# EAGLE schematic tulip breakout (EAGLE 9.6.2)
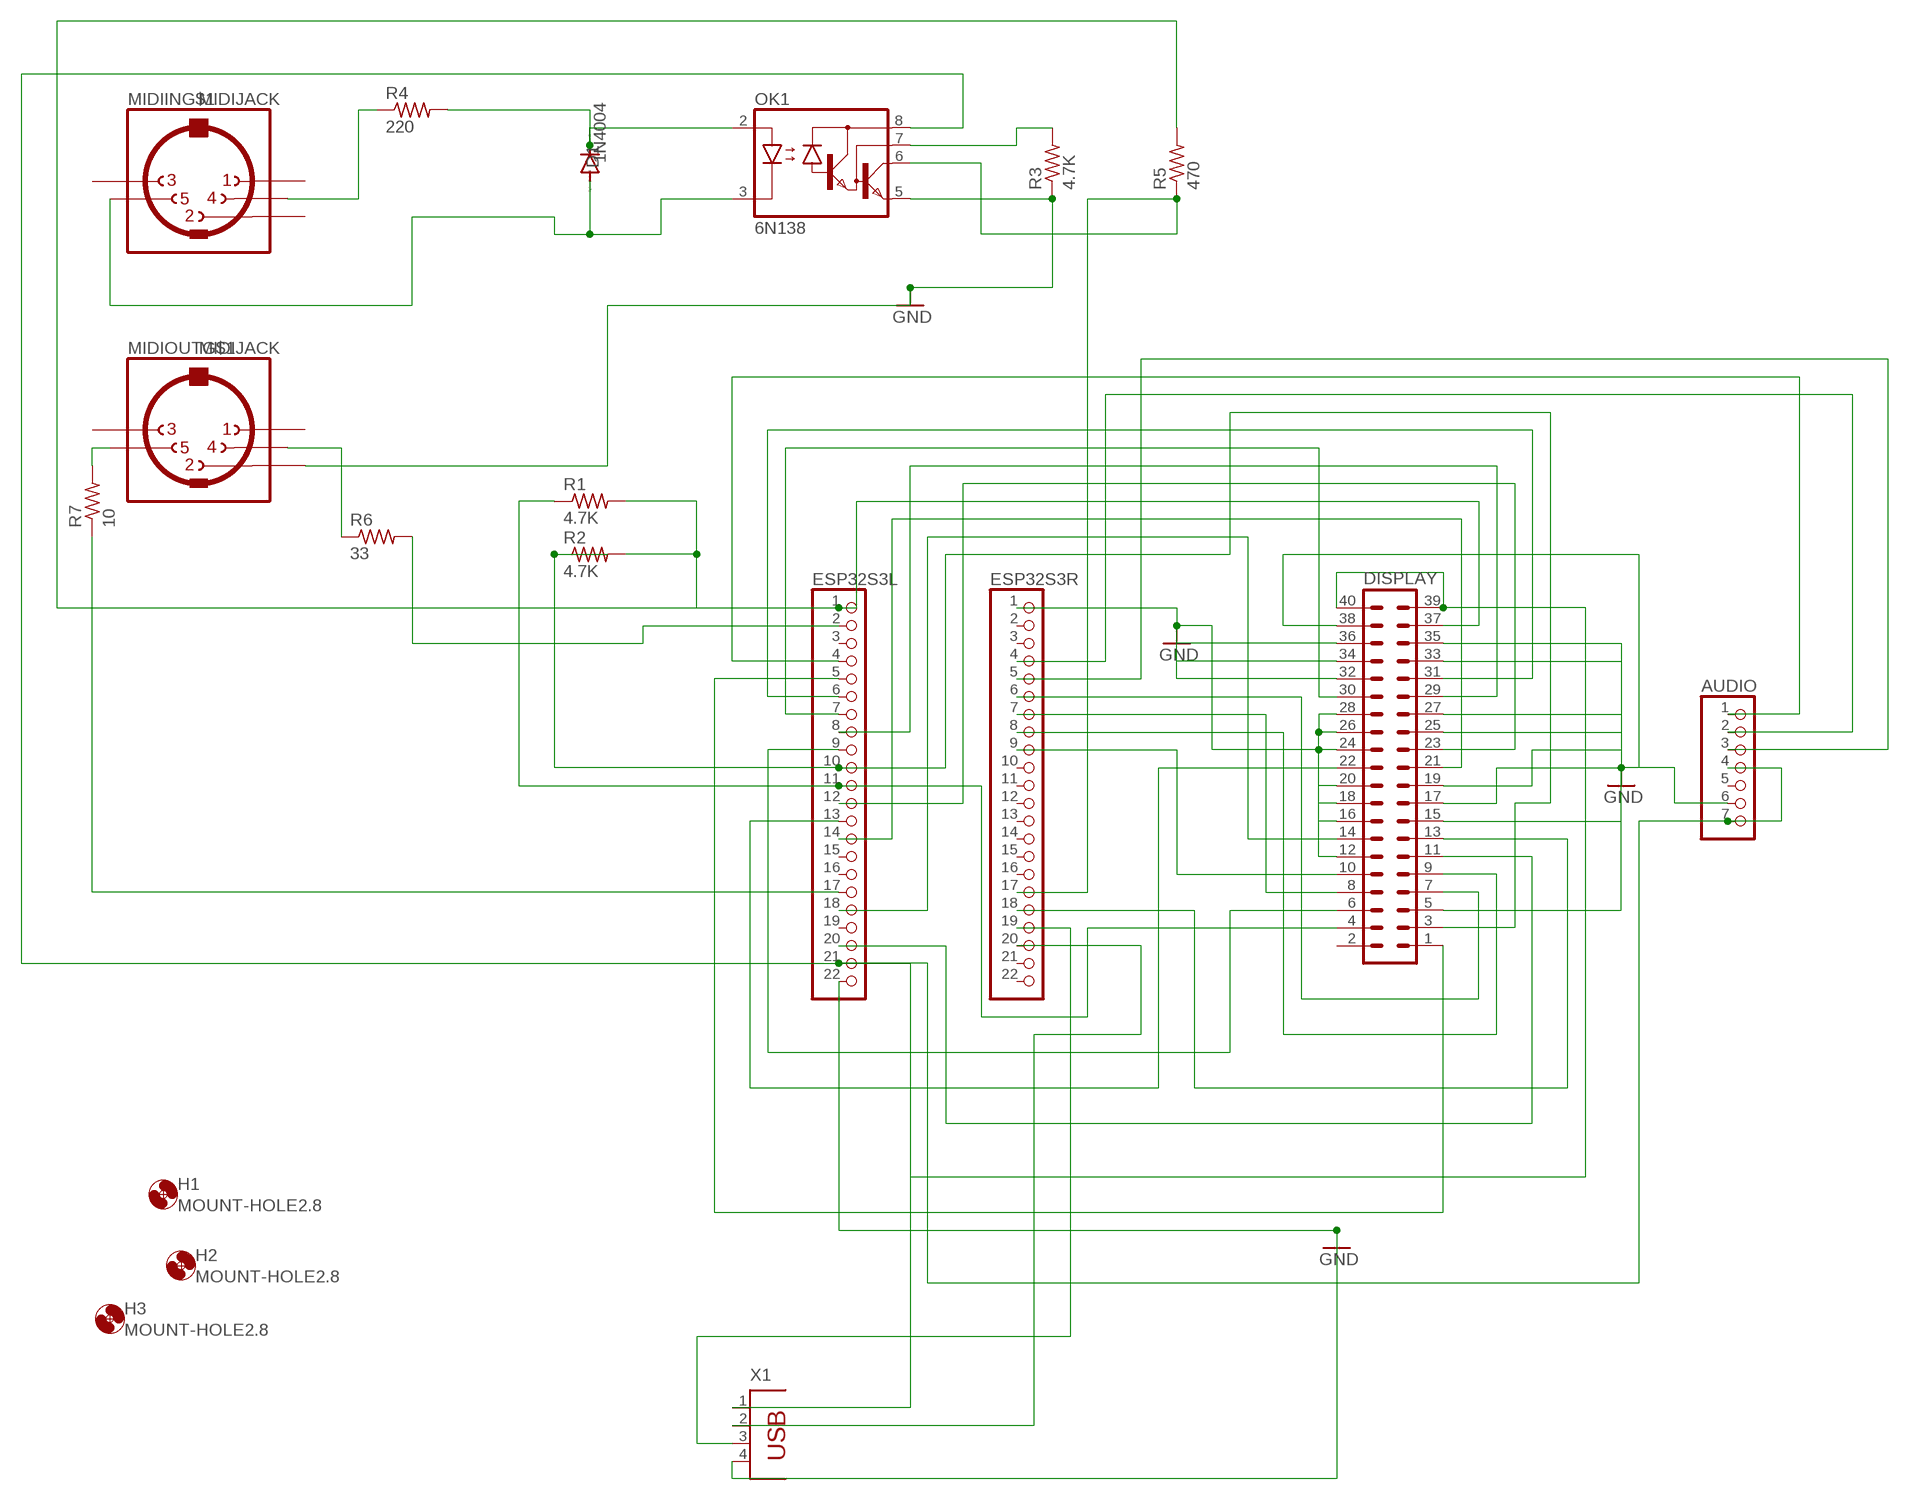
[diagram p0: schematic, sheet 1]

## Parts
AUDIO  PINHD-1X7  [1X07]
D1  1N4004  [DO41-10]
DISPLAY  MA20-2  [MA20-2]
ESP32S3L  PINHD-1X22  [1X22]
ESP32S3R  PINHD-1X22  [1X22]
H1  MOUNT-HOLE2.8  [2,8]
H2  MOUNT-HOLE2.8  [2,8]
H3  MOUNT-HOLE2.8  [2,8]
MIDIIN  MIDIJACK  [CP-2350]
MIDIOUT  MIDIJACK  [CP-2350]
OK1  6N138  [DIL08]
R1  4.7K  R-US_0204/7  [0204/7]
R2  4.7K  R-US_0204/7  [0204/7]
R3  4.7K  R-US_0204/7  [0204/7]
R4  220  R-US_0204/7  [0204/7]
R5  470  R-US_0204/7  [0204/7]
R6  33  R-US_0204/7  [0204/7]
R7  10  R-US_0204/7  [0204/7]
X1  PN87520  [PN87520]

## Nets
GND: AUDIO.6 DISPLAY.5 DISPLAY.12 DISPLAY.15 DISPLAY.16 DISPLAY.17 DISPLAY.18 DISPLAY.19 DISPLAY.20 DISPLAY.24 DISPLAY.25 DISPLAY.26 DISPLAY.27 DISPLAY.28 DISPLAY.32 DISPLAY.33 DISPLAY.34 DISPLAY.35 DISPLAY.36 DISPLAY.38 ESP32S3L.22 ESP32S3R.1 MIDIOUT.2 OK1.5(GND) R3.1 X1.4
N$1: DISPLAY.6 ESP32S3L.9
N$2: DISPLAY.7 ESP32S3R.6
N$3: DISPLAY.8 ESP32S3R.7
N$4: DISPLAY.9 ESP32S3R.8
N$6: DISPLAY.10 ESP32S3R.9
N$7: DISPLAY.11 ESP32S3L.20
N$8: DISPLAY.13 ESP32S3R.18
N$9: DISPLAY.14 ESP32S3L.18
N$10: AUDIO.4 AUDIO.7 DISPLAY.39 DISPLAY.40 ESP32S3L.21 OK1.8(VCC) X1.1
N$11: DISPLAY.21 ESP32S3L.14
N$12: DISPLAY.22 ESP32S3L.13
N$13: DISPLAY.23 ESP32S3L.12
N$14: DISPLAY.29 ESP32S3L.8
N$15: DISPLAY.30 ESP32S3L.7
N$16: DISPLAY.31 ESP32S3L.6
N$17: DISPLAY.37 ESP32S3L.1 R1.2 R2.2 R5.2
N$18: DISPLAY.4 ESP32S3L.11 R1.1
N$19: ESP32S3R.17 OK1.6(VO) R5.1
N$20: DISPLAY.1 ESP32S3L.5
N$21: AUDIO.1 ESP32S3L.4
N$22: AUDIO.2 ESP32S3R.4
N$23: AUDIO.3 ESP32S3R.5
N$24: ESP32S3R.20 X1.2
N$25: ESP32S3R.19 X1.3
N$26: DISPLAY.3 ESP32S3L.10 R2.1
N$27: ESP32S3L.17 R7.1
N$29: MIDIIN.4 R4.1
N$30: D1.C OK1.2(A) R4.2
N$31: D1.A MIDIIN.5 OK1.3(C)
N$32: OK1.7(VB) R3.2
N$34: MIDIOUT.5 R7.2
N$35: MIDIOUT.4 R6.1
N$36: ESP32S3L.2 R6.2
Unconnected: AUDIO.5 DISPLAY.2 ESP32S3L.3 ESP32S3L.15 ESP32S3L.16 ESP32S3L.19 ESP32S3R.2 ESP32S3R.3 ESP32S3R.10 ESP32S3R.11 ESP32S3R.12 ESP32S3R.13 ESP32S3R.14 ESP32S3R.15 ESP32S3R.16 ESP32S3R.21 ESP32S3R.22 MIDIIN.1 MIDIIN.2 MIDIIN.3 MIDIIN.PE1(MT) MIDIIN.PE2(MT) MIDIIN.PE(MT) MIDIIN.PE@(MT) MIDIOUT.1 MIDIOUT.3 MIDIOUT.PE1(MT) MIDIOUT.PE2(MT) MIDIOUT.PE(MT) MIDIOUT.PE@(MT)

## Library data of the parts
AUDIO = pinhead:PINHD-1X7: PIN HEADER
D1 = diode:1N4004: DIODE general purpose rectifier, 1 A
DISPLAY = con-lstb:MA20-2: PIN HEADER; OC_FARNELL: unknown; OC_NEWARK: unknown
ESP32S3L ESP32S3R = pinhead:PINHD-1X22: PIN HEADER
H1-H3 = holes:MOUNT-HOLE: MOUNTING HOLE with drill center marker
MIDIIN MIDIOUT = adafruit:MIDIJACK: DIN 5 jack also known as MIDI jack A modification of conn-hirshman:MAB5SH with two options for the grounding 'teeth'
OK1 = optocoupler:6N138: MOTOROLA OPTO COUPLER; MF: VISHAY/TELEFUNKEN; MPN: 6N138; OC_FARNELL: 9860150; OC_NEWARK: 35K5294
R1-R7 = rcl:R-US_: RESISTOR, American symbol; SPICEPREFIX: R
X1 = con-berg:PN87520: BERG USB connector; OC_FARNELL: unknown; OC_NEWARK: unknown